# Altium project Calcul8.PrjPcb
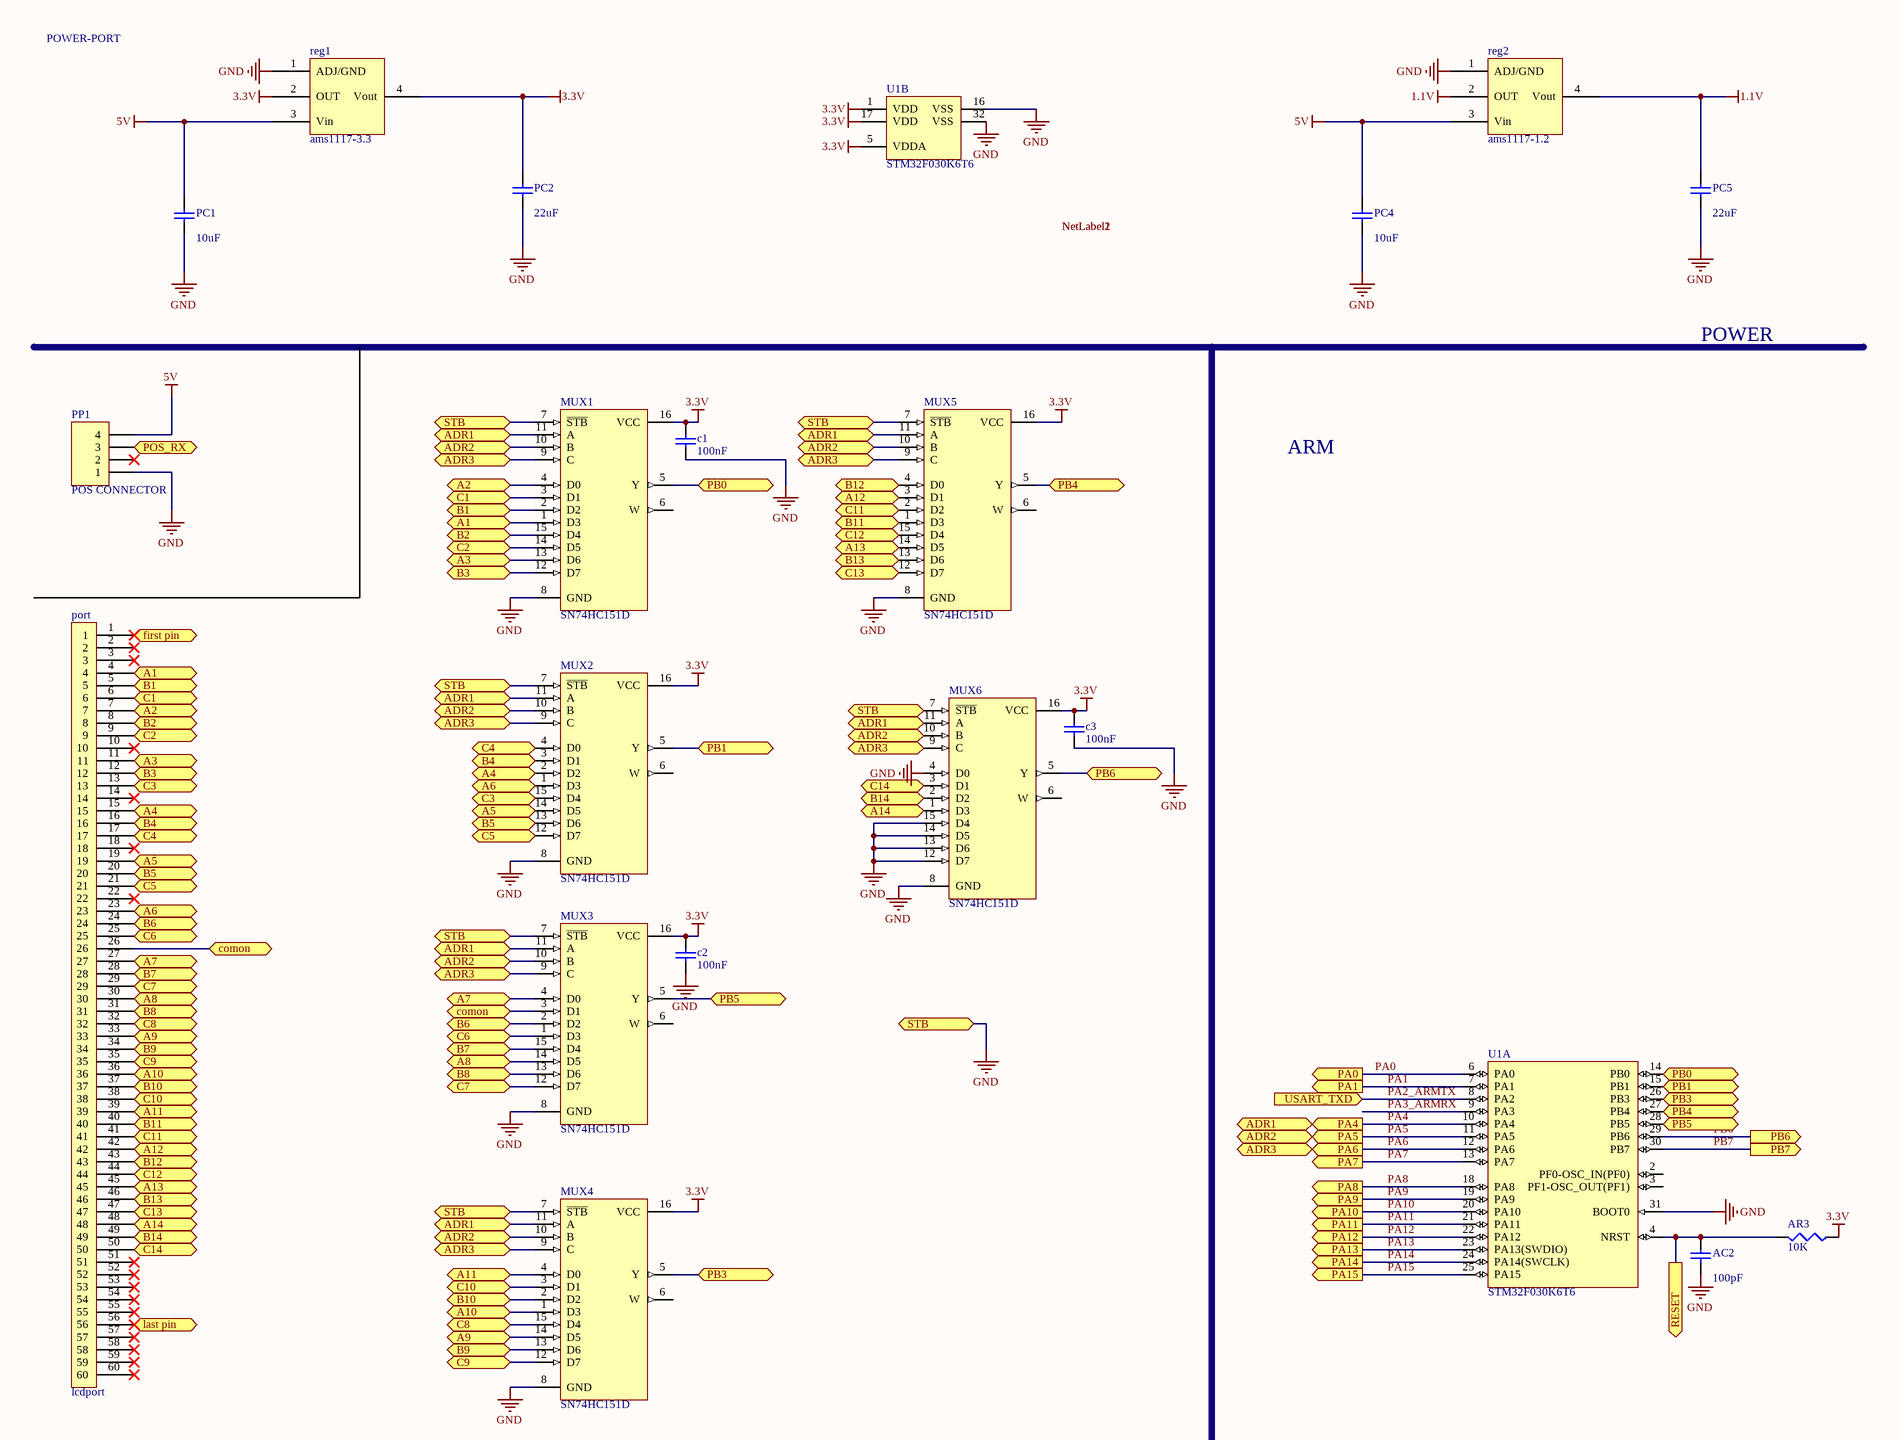
[diagram p0: Calcul8_SCH.SchDoc, top]
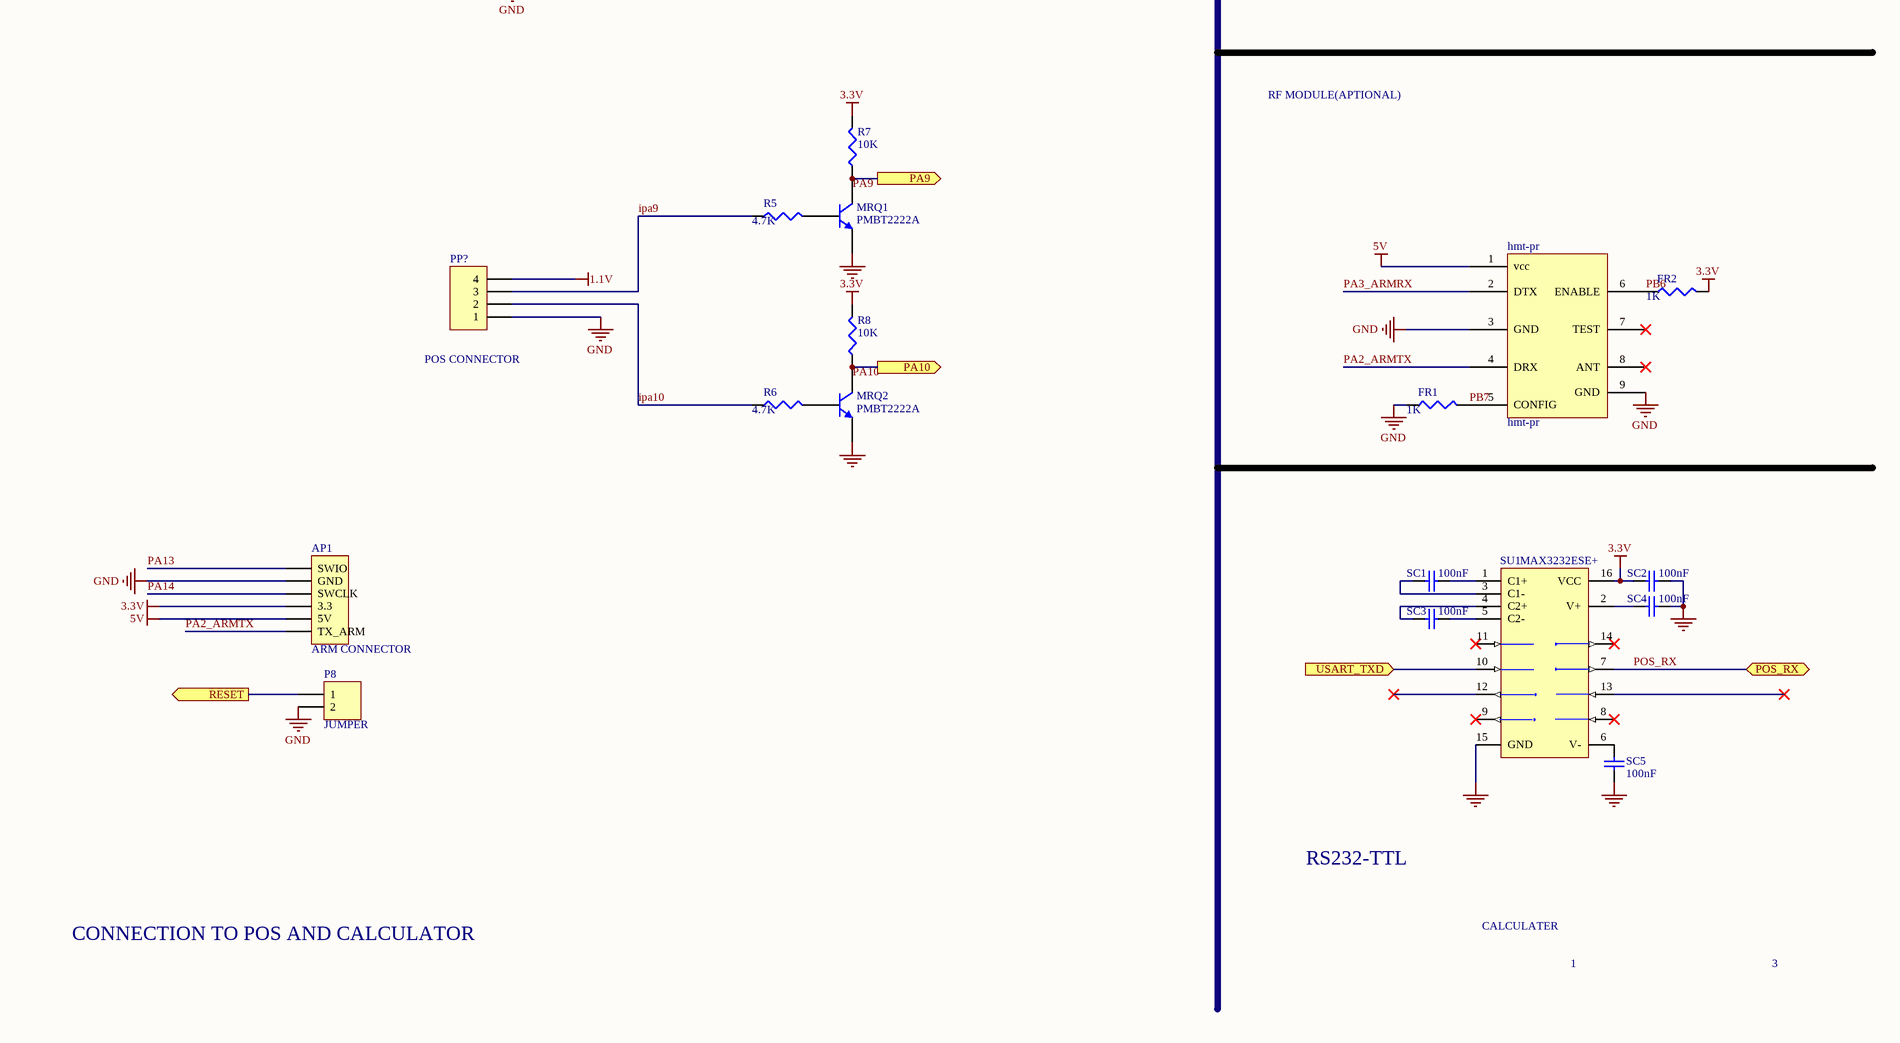
[diagram p1: Calcul8_SCH.SchDoc, bottom]
1 sheet, 38 parts. Net scope: flat (ports and power ports of the same name join across sheets).
Board file: Calcul8_PCB.PcbDoc

## Sheet Calcul8_SCH.SchDoc
size 381 x 495 mm; DocumentNumber: 1; Revision: J; CurrentTime: 30/3/97; DocumentName: CALCULATOR

### Parts
AC2  value 100pF  [C1206]  (hidden comment: Cap Semi)
AP1  ARM CONNECTOR  [HDR1X6]
AR3  value 10K  [c1206]  (hidden comment: Res3)
c1  100nF  [C1206]
c2  100nF  [C1206]
c3  100nF  [C1206]
FR1  value 1K  [c1206]  (hidden comment: Res3)
FR2  value 1K  [c1206]  (hidden comment: Res3)
hmt-pr  hmt-pr  [hmtrp]
MRQ1  PMBT2222A  [SOT-23_M]
MRQ2  PMBT2222A  [SOT-23_M]
MUX1  SN74HC151D  [mux]
MUX2  SN74HC151D  [mux]
MUX3  SN74HC151D  [mux]
MUX4  SN74HC151D  [mux]
MUX5  SN74HC151D  [mux]
MUX6  SN74HC151D  [mux]
P8  JUMPER  [HDR1X2]
PC1  value 10uF  [C1206]  (hidden comment: PC1)
PC2  value 22uF  [C1206]  (hidden comment: Cap Semi)
PC4  value 10uF  [C1206]  (hidden comment: PC1)
PC5  value 22uF  [C1206]  (hidden comment: Cap Semi)
port  lcdport  [INPUT_LCD]
PP1  POS CONNECTOR  [HDR1X4]
PP?  POS CONNECTOR  [HDR1X4]
R5  value 4.7K  [c1206]  (hidden comment: Res3)
R6  value 4.7K  [c1206]  (hidden comment: Res3)
R7  value 10K  [c1206]  (hidden comment: Res3)
R8  value 10K  [c1206]  (hidden comment: Res3)
reg1  ams1117-3.3  [ams]
reg2  ams1117-1.2  [ams]
SC1  100nF  [C1206]
SC2  100nF  [C1206]
SC3  100nF  [C1206]
SC4  100nF  [C1206]
SC5  100nF  [C1206]
SU1  MAX3232ESE+  [SO16_N]
U1  STM32F030K6T6  [stm32]  (parts A,B of 2)

### Ports
A1, A2, A3, A4, A5, A6, A7, A8, A9, A10, A11, A12, A13, A14, ADR1 (bidir), ADR2 (bidir), ADR3 (bidir), B1, B2, B3, B4, B5, B6, B7, B8, B9, B10, B11, B12, B13, B14, C1, C2, C3, C4, C5, C6, C7, C8, C9, C10, C11, C12, C13, C14, comon, first pin, last pin, PA0 (out), PA1 (out), PA4 (out), PA5 (out), PA6 (out), PA7 (out), PA8 (out), PA9 (out), PA10 (out), PA11 (out), PA12 (out), PA13 (out), PA14 (out), PA15 (out), PB0, PB1, PB3, PB4, PB5, PB6, PB6 (out), PB7 (out), POS_RX (bidir), RESET (out), STB (bidir), USART_TXD (in)

### Nets
1.1V: PC5.1 PP?.4 reg2.2(OUT) reg2.4(Vout)
3.3V: AP1.4(3.3) AR3.1 c1.2 c2.1 c3.2 FR2.2 MUX1.16(VCC) MUX2.16(VCC) MUX3.16(VCC) MUX4.16(VCC) MUX5.16(VCC) MUX6.16(VCC) PC2.1 R7.2 R8.2 reg1.2(OUT) reg1.4(Vout) SC2.2 SU1.16(VCC) U1.1(VDD) U1.5(VDDA) U1.17(VDD)
5V: AP1.5(5V) hmt-pr.1(vcc) PC1.1 PC4.1 PP1.4 reg1.3(Vin) reg2.3(Vin)
GND: AC2.2 AP1.2(GND) c1.1 c2.2 c3.1 FR1.1 hmt-pr.3(GND) hmt-pr.9(GND) MRQ1.2(E) MRQ2.2(E) MUX1.7(~{STB}) MUX1.8(GND) MUX2.7(~{STB}) MUX2.8(GND) MUX3.7(~{STB}) MUX3.8(GND) MUX4.7(~{STB}) MUX4.8(GND) MUX5.7(~{STB}) MUX5.8(GND) MUX6.4(D0) MUX6.7(~{STB}) MUX6.8(GND) MUX6.12(D7) MUX6.13(D6) MUX6.14(D5) MUX6.15(D4) P8.2 PC1.2 PC2.2 PC4.2 PC5.2 PP1.1 PP?.1 reg1.1(ADJ/GND) reg2.1(ADJ/GND) SC2.1 SC4.2 SC5.1 SU1.15(GND) U1.16(VSS) U1.31(BOOT0) U1.32(VSS) ; port STB
ipa9: PP?.3 R5.1
ipa10: PP?.2 R6.1
PA0: U1.6(PA0) ; port PA0
PA1: U1.7(PA1) ; port PA1
PA2_ARMTX: AP1.6(TX_ARM) hmt-pr.4(DRX) SU1.10(T2IN) U1.8(PA2) ; port USART_TXD
PA3_ARMRX: hmt-pr.2(DTX) U1.9(PA3)
PA4: MUX1.11(A) MUX2.11(A) MUX3.11(A) MUX4.11(A) MUX5.11(A) MUX6.11(A) U1.10(PA4) ; port PA4, port ADR1
PA5: MUX1.10(B) MUX2.10(B) MUX3.10(B) MUX4.10(B) MUX5.10(B) MUX6.10(B) U1.11(PA5) ; port PA5, port ADR2
PA6: MUX1.9(C) MUX2.9(C) MUX3.9(C) MUX4.9(C) MUX5.9(C) MUX6.9(C) U1.12(PA6) ; port PA6, port ADR3
PA7: U1.13(PA7) ; port PA7
PA8: U1.18(PA8) ; port PA8
PA9: MRQ1.3(C) R7.1 U1.19(PA9) ; port PA9
PA10: MRQ2.3(C) R8.1 U1.20(PA10) ; port PA10
PA11: U1.21(PA11) ; port PA11
PA12: U1.22(PA12) ; port PA12
PA13: AP1.1(SWIO) U1.23(PA13(SWDIO)) ; port PA13
PA14: AP1.3(SWCLK) U1.24(PA14(SWCLK)) ; port PA14
PA15: U1.25(PA15) ; port PA15
PB6: FR2.1 hmt-pr.6(ENABLE) MUX6.5(Y) U1.29(PB6) ; port PB6
PB7: FR1.2 hmt-pr.5(CONFIG) U1.30(PB7) ; port PB7
POS_RX: PP1.3 SU1.7(T2OUT) ; port POS_RX
NetAC2_1: AC2.1 AR3.2 P8.1 U1.4(NRST) ; port RESET
NetMRQ1_1: MRQ1.1(B) R5.2
NetMRQ2_1: MRQ2.1(B) R6.2
NetMUX1_1: MUX1.1(D3) port.4 ; port A1
NetMUX1_2: MUX1.2(D2) port.5 ; port B1
NetMUX1_3: MUX1.3(D1) port.6 ; port C1
NetMUX1_4: MUX1.4(D0) port.7 ; port A2
NetMUX1_5: MUX1.5(Y) U1.14(PB0) ; port PB0
NetMUX1_12: MUX1.12(D7) port.12 ; port B3
NetMUX1_13: MUX1.13(D6) port.11 ; port A3
NetMUX1_14: MUX1.14(D5) port.9 ; port C2
NetMUX1_15: MUX1.15(D4) port.8 ; port B2
NetMUX2_1: MUX2.1(D3) port.23 ; port A6
NetMUX2_2: MUX2.2(D2) port.15 ; port A4
NetMUX2_3: MUX2.3(D1) port.16 ; port B4
NetMUX2_4: MUX2.4(D0) port.17 ; port C4
NetMUX2_5: MUX2.5(Y) U1.15(PB1) ; port PB1
NetMUX2_12: MUX2.12(D7) port.21 ; port C5
NetMUX2_13: MUX2.13(D6) port.20 ; port B5
NetMUX2_14: MUX2.14(D5) port.19 ; port A5
NetMUX2_15: MUX2.15(D4) port.13 ; port C3
NetMUX3_1: MUX3.1(D3) port.25 ; port C6
NetMUX3_2: MUX3.2(D2) port.24 ; port B6
NetMUX3_3: MUX3.3(D1) port.26 ; port comon
NetMUX3_4: MUX3.4(D0) port.27 ; port A7
NetMUX3_5: MUX3.5(Y) U1.28(PB5) ; port PB5
NetMUX3_12: MUX3.12(D7) port.29 ; port C7
NetMUX3_13: MUX3.13(D6) port.31 ; port B8
NetMUX3_14: MUX3.14(D5) port.30 ; port A8
NetMUX3_15: MUX3.15(D4) port.28 ; port B7
NetMUX4_1: MUX4.1(D3) port.36 ; port A10
NetMUX4_2: MUX4.2(D2) port.37 ; port B10
NetMUX4_3: MUX4.3(D1) port.38 ; port C10
NetMUX4_4: MUX4.4(D0) port.39 ; port A11
NetMUX4_5: MUX4.5(Y) U1.26(PB3) ; port PB3
NetMUX4_12: MUX4.12(D7) port.35 ; port C9
NetMUX4_13: MUX4.13(D6) port.34 ; port B9
NetMUX4_14: MUX4.14(D5) port.33 ; port A9
NetMUX4_15: MUX4.15(D4) port.32 ; port C8
NetMUX5_1: MUX5.1(D3) port.40 ; port B11
NetMUX5_2: MUX5.2(D2) port.41 ; port C11
NetMUX5_3: MUX5.3(D1) port.42 ; port A12
NetMUX5_4: MUX5.4(D0) port.43 ; port B12
NetMUX5_5: MUX5.5(Y) U1.27(PB4) ; port PB4
NetMUX5_12: MUX5.12(D7) port.47 ; port C13
NetMUX5_13: MUX5.13(D6) port.46 ; port B13
NetMUX5_14: MUX5.14(D5) port.45 ; port A13
NetMUX5_15: MUX5.15(D4) port.44 ; port C12
NetMUX6_1: MUX6.1(D3) port.48 ; port A14
NetMUX6_2: MUX6.2(D2) port.49 ; port B14
NetMUX6_3: MUX6.3(D1) port.50 ; port C14
Netport_1: port.1 ; port first pin
Netport_56: port.56 ; port last pin
NetSC1_1: SC1.1 SU1.3(C1-)
NetSC1_2: SC1.2 SU1.1(C1+)
NetSC3_1: SC3.1 SU1.4(C2+)
NetSC3_2: SC3.2 SU1.5(C2-)
NetSC4_1: SC4.1 SU1.2(V+)
NetSC5_2: SC5.2 SU1.6(V-)

Not connected (* = marked no-connect by the designer): hmt-pr 7(TEST)* 8(ANT)*; MUX1 6(W); MUX2 6(W); MUX3 6(W); MUX4 6(W); MUX5 6(W); MUX6 6(W); port 2* 3* 10* 14* 18* 22* 51* 52* 53* 54* 55* 57* 58* 59* 60*; PP1 2*; SU1 8(R2IN)* 9(R2OUT)* 11(T1IN)* 12(R1OUT)* 13(R1IN)* 14(T1OUT)*; U1 2(PF0-OSC_IN(PF0)) 3(PF1-OSC_OUT(PF1))

### Notes on the sheet
- POWER-PORT
- POWER
- ARM
- RF MODULE(APTIONAL)
- RS232-TTL
- CALCULATER
- CONNECTION TO POS AND CALCULATOR
- 1
- 3
- Labels drawn without touching a wire or pin: PA9, PA10

### Library data of the parts
AC2 PC1 PC2 PC4 PC5 = Cap Semi: Capacitor (Semiconductor SIM Model); Published: 8-Jun-2000; LatestRevisionDate: 29-May-2009; LatestRevisionNote: IPC-7351 Footprint Added.; PackageReference: C1206; Publisher: Altium Limited; PackageDescription: Chip Capacitor
AP1 = Header 6: Header, 6-Pin; LatestRevisionDate: 17-Jul-2002; LatestRevisionNote: Re-released for DXP Platform.; Publisher: Altium Limited
AR3 FR1 FR2 R5-R8 = Res3: Resistor; Published: 8-Jun-2000; LatestRevisionDate: 29-May-2009; LatestRevisionNote: IPC-7351 Footprint Added.; PackageReference: J1-0603; Publisher: Altium Limited; PackageDescription: Chip Resistor
c1-c3 SC1-SC5 = Cap Semi: Capacitor; Tolerance: 10%; Dielectric: X7R; Company: AVX; Foreign Supplyer: False; Value: 100nF; Category: Capacitor; Subcategory: Ceramic; Package: 0603; Part Number: *; Voltage: *; Power: *
MRQ1 MRQ2 = NPN: NPN Bipolar Transistor; Published: 8-Jun-2000; LatestRevisionDate: 17-Jul-2002; LatestRevisionNote: Re-released for DXP Platform.; PackageReference: TO-226-AA; Publisher: Altium Limited; PackageDescription: TO, Flat Index; 3 In-Line, Axial Leads; Body Dia. 4.8mm; Leads 0.55 x 0.51 mm (max); Code_JEDEC: TO-226-AA
MUX1-MUX6 = SN74HC151D: 8-Line to 1-Line Data Selector/Multiplexer; Published: 8-Jun-2000; LatestRevisionDate: 13-Apr-2006; LatestRevisionNote: IPC-7351 Footprint Added.; DatasheetVersion: May-1997; PackageVersion: Jan-1998; PackageReference: D016; Publisher: Altium Limited; PackageDescription: 16-Pin Small Outline Integrated Circuit 1.27 mm Pitch; Code_IPC: SOIC127P600-16; ComponentLink1Description: Manufacturer Link; ComponentLink1URL: http://www.ti.com/; ComponentLink2Description: Datasheet; ComponentLink2URL: http://www-s.ti.com/sc/ds/sn74hc151.pdf
P8 = Header 2: Header, 2-Pin; LatestRevisionDate: 17-Jul-2002; LatestRevisionNote: Re-released for DXP Platform.; Publisher: Altium Limited
port = lcdport: pl
PP1 PP? = Header 4H: Header, 4-Pin, Right Angle; LatestRevisionDate: 17-Jul-2002; LatestRevisionNote: Re-released for DXP Platform.; Publisher: Altium Limited
reg2 = ams1117-3.3
SU1 = MAX3232CSE: 3.0V TO 5.5V, Low-Power, up to 1Mbps, True RS-232 Transceiver Using Four 0.1µF External Capacitor; Company: MAXIM; Foreign Supplyer: False; Category: IC; Subcategory: MAX; Dielectric: *; Package: SO16; Part Number: MAX3232ESE+; Power.: *; Tolerance: *; Value: MAX3232ESE+; Voltage: *
U1 = STM32F030K6T6: ARM Cortex-M0 32-bit MCU, 32 KB Flash, 4 KB Internal RAM, 26 I/Os, 32-pin LQFP, -40 to 85 degC, Tray; FLASH Size (Prog) (kB): 32; I/Os (High Current): 26; Internal RAM Size (kB): 4; Operating Frequency(F) (Processor speed) (MHz): 48; Supply Voltage(Vcc) min (V): 2.4; DatasheetVersion: Rev. 1; PackageVersion: Rev. 1, 07/2013; PackageReference: LQFP32; PackageDescription: 32-Pin Low Profile Quad Flat Package, 7 x 7 mm Body, 0.8 mm Pitch; Supplier 1: Digi-Key; Supplier Part Number 1: 497-14046-ND; Supplier 2: Newark; Supplier Part Number 2: 19X6194; Supplier 3: Mouser; Supplier Part Number 3: 511-STM32F030K6T6; Core: ARM Cortex-M0; Packing: Tray; Mounting Technology: Surface Mount; PartNumber: STM32F030K6T6; ComponentLink1Description: Manufacturer URL; ComponentLink1URL: http://www.st.com/web/en/home.html; ComponentLink2Description: Datasheet; ComponentLink2URL: http://www.st.com/st-web-ui/static/active/en/resource/technical/document/datasheet/DM00088500.pdf; ComponentLink3Description: Package Specification; ComponentLink3URL: http://www.st.com/st-web-ui/static/active/en/resource/technical/document/datasheet/DM00088500.pdf